# Altium project arca.PrjPCB
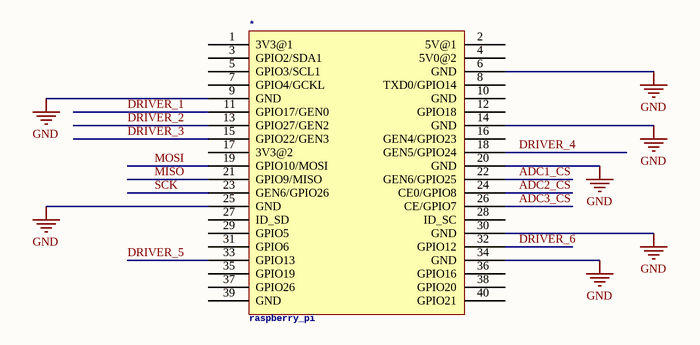
[diagram p0: PI_SCH.SchDoc]
9 sheets, 193 parts. Net scope: global (net labels, ports and power ports of the same name join across sheets).
Board file: arca.PcbDoc
Sheets:
  PI_SCH.SchDoc
  Power.SchDoc
  PT_to_ADCs.SchDoc
  LC_to_ADC.SchDoc
  ADC_SCH.SchDoc
  Load_Cells_SCH.SchDoc
  Pressure_Transducers_SCH.SchDoc
  Connectors.SchDoc
  drivers_SCH.SchDoc

## Sheet PI_SCH.SchDoc
size A

### Parts
*  raspberry_pi

### Nets
GND: *.6(GND) *.9(GND) *.14(GND) *.20(GND) *.25(GND) *.30(GND) *.34(GND)
ADC1_CS: *.22(GEN6/GPIO25)
ADC2_CS: *.24(CE0/GPIO8)
ADC3_CS: *.26(CE/GPIO7)
DRIVER_1: *.11(GPIO17/GEN0)
DRIVER_2: *.13(GPIO27/GEN2)
DRIVER_3: *.15(GPIO22/GEN3)
DRIVER_4: *.18(GEN5/GPIO24)
DRIVER_5: *.33(GPIO13)
DRIVER_6: *.32(GPIO12)
MISO: *.21(GPIO9/MISO)
MOSI: *.19(GPIO10/MOSI)
SCK: *.23(GEN6/GPIO26)

Not connected (* = marked no-connect by the designer): * 1(3V3@1) 2(5V@1) 3(GPIO2/SDA1) 4(5V0@2) 5(GPIO3/SCL1) 7(GPIO4/GCKL) 8(TXD0/GPIO14) 10(GND) 12(GPIO18) 16(GEN4/GPIO23) 17(3V3@2) 27(ID_SD) 28(ID_SC) 29(GPIO5) 31(GPIO6) 35(GPIO19) 36(GPIO16) 37(GPIO26) 38(GPIO20) 39(GND) 40(GPIO21)

## Sheet Power.SchDoc
size A
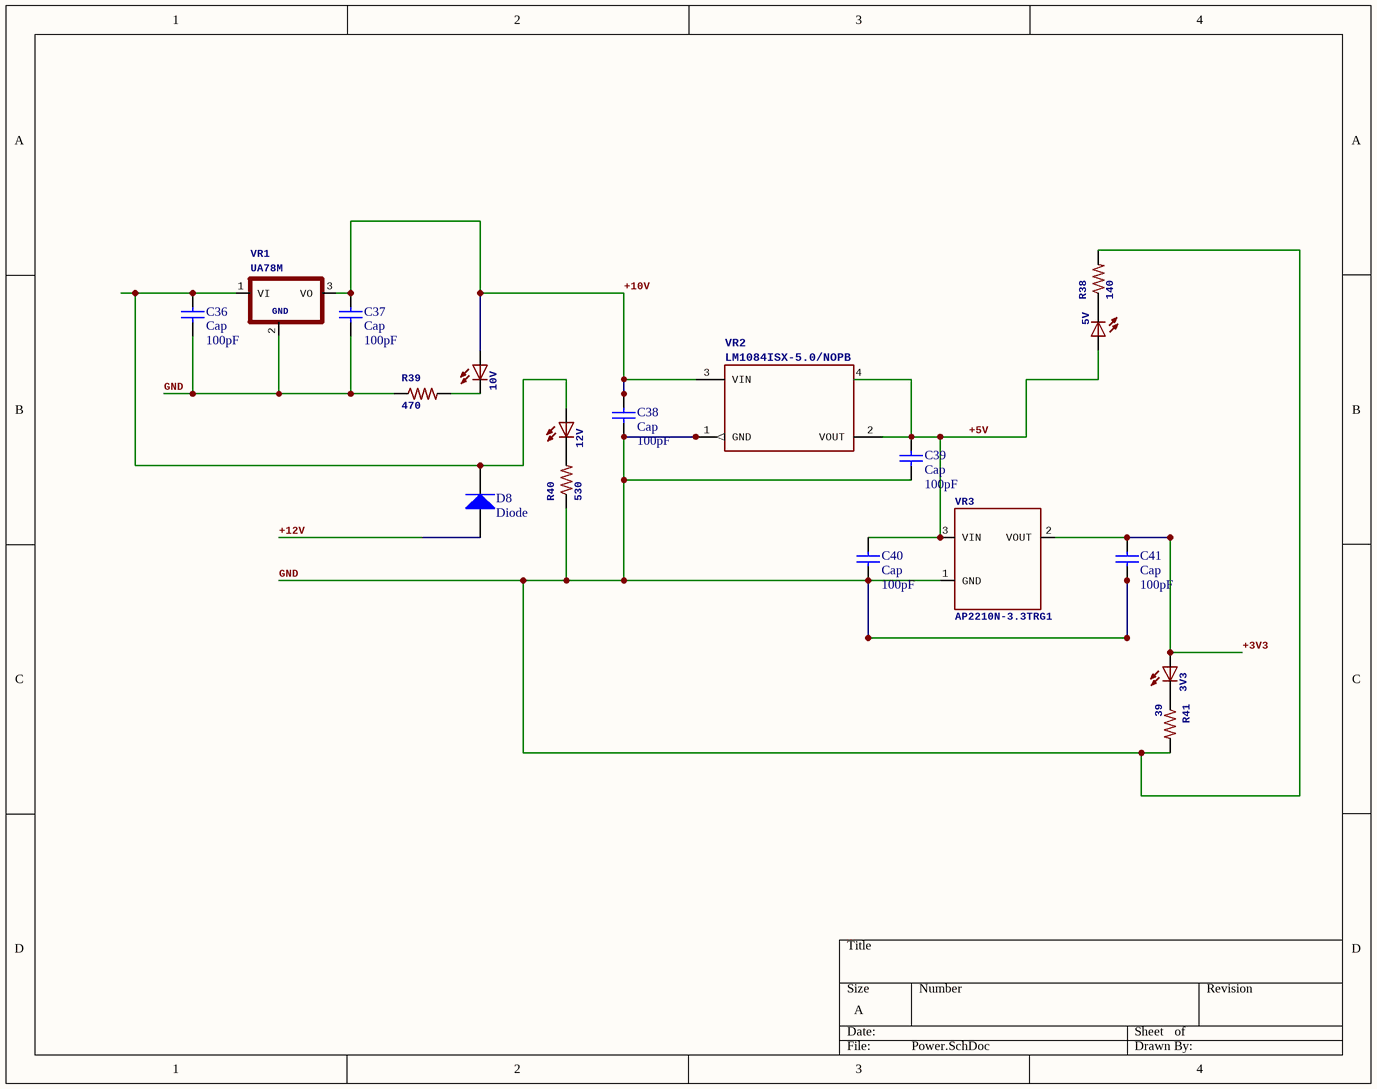
[diagram p1: Power.SchDoc]

### Parts
3V3  LED5MM  [LED5MM]  (value not drawn)
5V  LED5MM  [LED5MM]  (value not drawn)
10V  LED5MM  [LED5MM]  (value not drawn)
12V  LED5MM  [LED5MM]  (value not drawn)
C36  Cap  value 100pF  [CAPCP2012X06N]
C37  Cap  value 100pF  [CAPCP2012X06N]
C38  Cap  value 100pF  [CAPCP2012X06N]
C39  Cap  value 100pF  [CAPCP2012X06N]
C40  Cap  value 100pF  [CAPCP2012X06N]
C41  Cap  value 100pF  [CAPCP2012X06N]
D8  Diode  [DIODE-0.7]
R38  140  [RESC_0805_2012]
R39  470  [RESC_0805_2012]
R40  530  [RESC_0805_2012]
R41  39  [RESC_0805_2012]
VR1  UA78M  [UA78M]
VR2  LM1084ISX-5.0/NOPB  [LM1084ISX-5.0/NOPB]
VR3  AP2210N-3.3TRG1  [SOT95P245X110-3N]

### Nets
+3V3: 3V3.A C41.2 VR3.2(VOUT)
GND: C36.1 C37.1 C38.1 C39.1 C40.1 C41.1 R38.2 R39.1 R40.1 R41.2 VR1.2(GND) VR2.1(GND) VR3.1(GND)
+5V: 5V.A C39.2 C40.2 VR2.2(VOUT) VR2.4 VR3.3(VIN)
+10V: 10V.A C37.2 C38.2 VR1.3(VO) VR2.3(VIN)
+12V: D8.1(A)
Net3V3_K: 3V3.K(C) R41.1
Net5V_K: 5V.K(C) R38.1
Net10V_K: 10V.K(C) R39.2
Net12V_A: 12V.A C36.2 D8.2(K) VR1.1(VI)
Net12V_K: 12V.K(C) R40.2

### Library data of the parts
3V3 5V 10V 12V = LED5MM: LEDOSRAM:- CHIPLEDLG R971, LG N971, LY N971, LG Q971, LY Q971, LO R971, LY R971 LH N974, LH R974LS Q976, LO Q976, LY Q976LO Q996- Hyper CHIPLEDLW Q18SLB Q993, LB Q99A, LB R99A- SideLEDLS A670, LO A670, LY A670, LG A670, LP A670LB A673, LV A673, LT A673, LW A673LH A674LY A675LS A676, LA A676, LO A676, LY A676, LW A676LS A679, LY A679, LG A679-  Hyper Micro SIDELEDÂ®LS Y876, LA Y876, LO Y876, LY Y876LT Y87S- SmartLEDLW L88C, LW L88SLB L89C, LB L89S, LG L890LS L89K, LO L89K, LY L89KLS L896, LA L896, LO L896, LY L896- TOPLEDLS T670, LO T670, LY T670, LG T670, LP T670LSG T670, LSP T670, LSY T670, LOP T670, LYG T670LG T671, LOG T671, LSG T671LB T673, LV T673, LT T673, LW T673LH T674LS T676, LA T676, LO T676, LY T676, LB T676, LH T676, LSB T676, LW T676LB T67C, LV T67C, LT T67C, LS T67K, LO T67K, LY T67K, LW E67CLS E67B, LA E67B, LO E67B, LY E67B, LB E67C, LV E67C, LT E67CLW T67CLS T679, LY T679, LG T679LS T770, LO T770, LY T770, LG T770, LP T770LB T773, LV T773, LT T773, LW T773LH T774LS E675, LA E675, LY E675, LS T675LS T776, LA T776, LO T776, LY T776, LB T776LHGB T686LT T68C, LB T68C- Hyper Mini TOPLEDÂ®LB M676- Mini TOPLED SantanaÂ®LG M470LS M47K, LO M47K, LY M47K Source: http://www.osram.convergy.deLUXEON:- LUMILEDÂ®LXK2-PW12-R00, LXK2-PW12-S00, LXK2-PW14-U00, LXK2-PW14-V00LXK2-PM12-R00, LXK2-PM12-S00, LXK2-PM14-U00LXK2-PE12-Q00, LXK2-PE12-R00, LXK2-PE12-S00, LXK2-PE14-T00, LXK2-PE14-U00LXK2-PB12-K00, LXK2-PB12-L00, LXK2-PB12-M00, LXK2-PB14-N00, LXK2-PB14-P00, LXK2-PB14-Q00LXK2-PR12-L00, LXK2-PR12-M00, LXK2-PR14-Q00, LXK2-PR14-R00LXK2-PD12-Q00, LXK2-PD12-R00, LXK2-PD12-S00LXK2-PH12-R00, LXK2-PH12-S00LXK2-PL12-P00, LXK2-PL12-Q00, LXK2-PL12-R00 Source: www.luxeon.comKINGBRIGHT:KA-3528ASYCSource: www.kingbright.com; GateName_1: G$1; SymbolName_1: LED; DeviceName: 5MM; LibraryName: led; DeviceSetName: LED
C36-C41 = Cap: Capacitor; Published: 8-Jun-2000; LatestRevisionDate: 17-Jul-2002; LatestRevisionNote: Re-released for DXP Platform.; PackageReference: RAD-0.3; Publisher: Altium Limited; PackageDescription: Radial Cap, Thru-Hole; 2 Leads; 0.3 in Pin Spacing
D8 = Diode: Default Diode; Published: 8-Jun-2000; LatestRevisionDate: 17-Jul-2002; LatestRevisionNote: Re-released for DXP Platform.; PackageVersion: Sep-1996; PackageReference: SMC; Publisher: Altium Limited; PackageDescription: DO-214-AB/SMC; 2 C-Bend Leads; Body 7.9 x 5.9 mm, inc. leads (LxW); Code_JEDEC: DO-214-AB
R38-R41 = R-US_R0805: RESISTOR, American symbol; GateName_1: G$1; SymbolName_1: R-US; DeviceName: R0805; DeviceSetName: R-US_; LibraryName: resistor
VR1 = UA78M*: POSITIVE-VOLTAGE REGULATORS Source: http://focus.ti.com/lit/ds/symlink/ua78m33.pdf; GateName_1: G$1; SymbolName_1: 78XX2GND; LibraryName: texas-extra; DeviceSetName: UA78M*; GND: GND
VR2 = LM1084ISX-5.0/NOPB: MANUFACTURER_PART_NUMBER: LM1084ISX5.0NOPB; GateName_1: A; SymbolName_1: LM1084IS-5.0; VENDOR: Texas Instruments; LibraryName: texas-extra; DeviceSetName: LM1084ISX-5.0/NOPB
VR3 = AP2210N-3.3TRG1: 3.3V regulator300mA rating.; GateName_1: G$1; SymbolName_1: AP2210N-3.3TRG1; LibraryName: diodes-extra; DeviceSetName: AP2210N-3.3TRG1

## Sheet PT_to_ADCs.SchDoc
size A
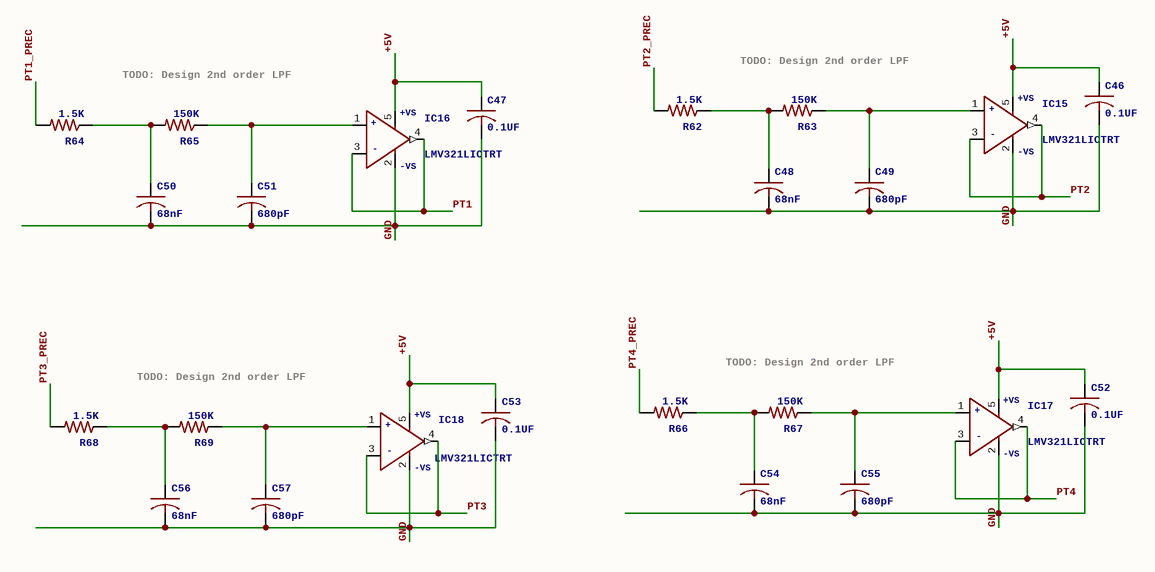
[diagram p2: PT_to_ADCs.SchDoc]

### Parts
C46  0.1UF  [CAPCP2012X06N]
C47  0.1UF  [CAPCP2012X06N]
C48  68nF  [CAPCP2012X06N]
C49  680pF  [CAPCP2012X06N]
C50  68nF  [CAPCP2012X06N]
C51  680pF  [CAPCP2012X06N]
C52  0.1UF  [CAPCP2012X06N]
C53  0.1UF  [CAPCP2012X06N]
C54  68nF  [CAPCP2012X06N]
C55  680pF  [CAPCP2012X06N]
C56  68nF  [CAPCP2012X06N]
C57  680pF  [CAPCP2012X06N]
IC15  LMV321LICTRT  [SOT95P245X110-5N]
IC16  LMV321LICTRT  [SOT95P245X110-5N]
IC17  LMV321LICTRT  [SOT95P245X110-5N]
IC18  LMV321LICTRT  [SOT95P245X110-5N]
R62  1.5K  [RESC_0805_2012]
R63  150K  [RESC_0805_2012]
R64  1.5K  [RESC_0805_2012]
R65  150K  [RESC_0805_2012]
R66  1.5K  [RESC_0805_2012]
R67  150K  [RESC_0805_2012]
R68  1.5K  [RESC_0805_2012]
R69  150K  [RESC_0805_2012]

### Nets
GND: C46.2 C47.2 C48.2 C49.2 C50.2 C51.2 C52.2 C53.2 C54.2 C55.2 C56.2 C57.2 IC15.2(-VS) IC16.2(-VS) IC17.2(-VS) IC18.2(-VS)
+5V: C46.1 C47.1 C52.1 C53.1 IC15.5(+VS) IC16.5(+VS) IC17.5(+VS) IC18.5(+VS)
PT1: IC16.3(IN-) IC16.4(OUT)
PT1_PREC: R64.2
PT2: IC15.3(IN-) IC15.4(OUT)
PT2_PREC: R62.2
PT3: IC18.3(IN-) IC18.4(OUT)
PT3_PREC: R68.2
PT4: IC17.3(IN-) IC17.4(OUT)
PT4_PREC: R66.2
NetC48_1: C48.1 R62.1 R63.2
NetC49_1: C49.1 IC15.1(IN+) R63.1
NetC50_1: C50.1 R64.1 R65.2
NetC51_1: C51.1 IC16.1(IN+) R65.1
NetC54_1: C54.1 R66.1 R67.2
NetC55_1: C55.1 IC17.1(IN+) R67.1
NetC56_1: C56.1 R68.1 R69.2
NetC57_1: C57.1 IC18.1(IN+) R69.1

### Notes on the sheet
- TODO: Design 2nd order LPF

### Library data of the parts
C46-C57 = C-USC0805: CAPACITOR, American symbol; GateName_1: G$1; SymbolName_1: C-US; DeviceName: C0805; LibraryName: rcl; DeviceSetName: C-US; SPICEPREFIX: C
IC15-IC18 = LMV321LICTRT: High Performance, 145 MHz FastFET Op AmpsSource: http://www.analog.com/static/imported-files/data_sheets/AD8065_8066.pdf; MPN: AD8065ARTZ-REEL7; GateName_1: G$; SymbolName_1: OP+-VS; DeviceName: RT; MF: ALTERA CORPORATION; LibraryName: st-microelectronics-extra; DeviceSetName: LMV321LICT; OC_FARNELL: 1464845; OC_NEWARK: 59K6316; +: +; -: -; +VS: +VS; -VS: -VS
R62-R69 = R-US_R0805: as R38 on sheet Power; LibraryName: rcl

## Sheet LC_to_ADC.SchDoc
size A
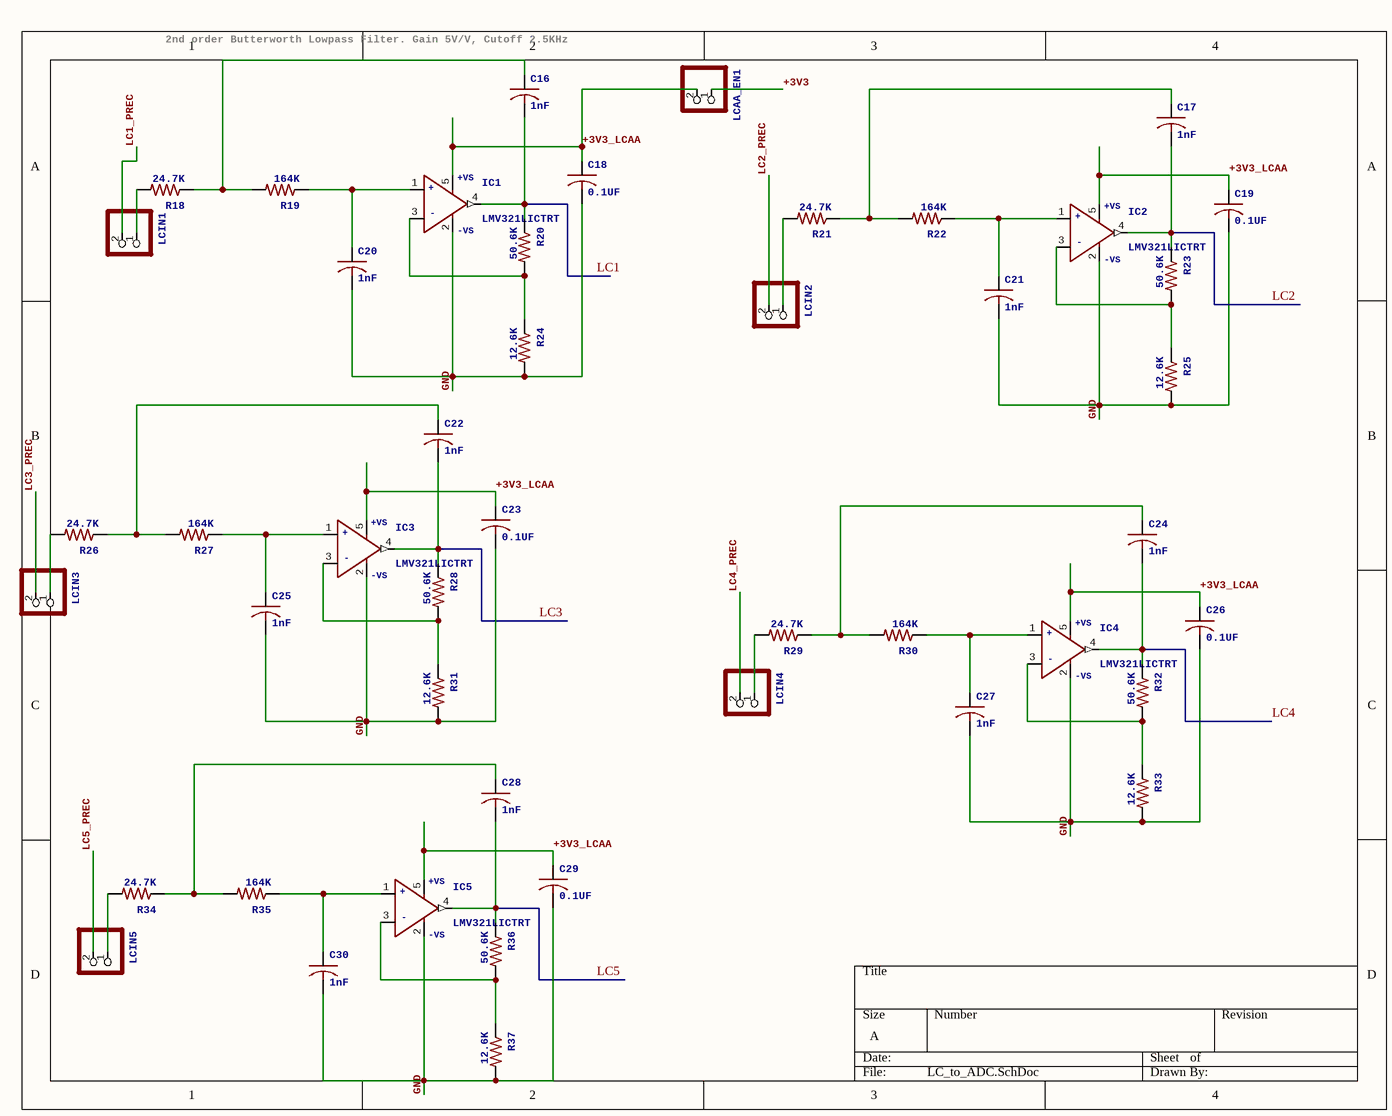
[diagram p3: LC_to_ADC.SchDoc]

### Parts
C16  1nF  [CAPCP2012X06N]
C17  1nF  [CAPCP2012X06N]
C18  0.1UF  [CAPCP2012X06N]
C19  0.1UF  [CAPCP2012X06N]
C20  1nF  [CAPCP2012X06N]
C21  1nF  [CAPCP2012X06N]
C22  1nF  [CAPCP2012X06N]
C23  0.1UF  [CAPCP2012X06N]
C24  1nF  [CAPCP2012X06N]
C25  1nF  [CAPCP2012X06N]
C26  0.1UF  [CAPCP2012X06N]
C27  1nF  [CAPCP2012X06N]
C28  1nF  [CAPCP2012X06N]
C29  0.1UF  [CAPCP2012X06N]
C30  1nF  [CAPCP2012X06N]
IC1  LMV321LICTRT  [SOT95P245X110-5N]
IC2  LMV321LICTRT  [SOT95P245X110-5N]
IC3  LMV321LICTRT  [SOT95P245X110-5N]
IC4  LMV321LICTRT  [SOT95P245X110-5N]
IC5  LMV321LICTRT  [SOT95P245X110-5N]
LCAA_EN1  PINHD-1X2  [MHDR1X2]  (value not drawn)
LCIN1  PINHD-1X2  [MHDR1X2]  (value not drawn)
LCIN2  PINHD-1X2  [MHDR1X2]  (value not drawn)
LCIN3  PINHD-1X2  [MHDR1X2]  (value not drawn)
LCIN4  PINHD-1X2  [MHDR1X2]  (value not drawn)
LCIN5  PINHD-1X2  [MHDR1X2]  (value not drawn)
R18  24.7K  [RESC_0805_2012]
R19  164K  [RESC_0805_2012]
R20  50.6K  [RESC_0805_2012]
R21  24.7K  [RESC_0805_2012]
R22  164K  [RESC_0805_2012]
R23  50.6K  [RESC_0805_2012]
R24  12.6K  [RESC_0805_2012]
R25  12.6K  [RESC_0805_2012]
R26  24.7K  [RESC_0805_2012]
R27  164K  [RESC_0805_2012]
R28  50.6K  [RESC_0805_2012]
R29  24.7K  [RESC_0805_2012]
R30  164K  [RESC_0805_2012]
R31  12.6K  [RESC_0805_2012]
R32  50.6K  [RESC_0805_2012]
R33  12.6K  [RESC_0805_2012]
R34  24.7K  [RESC_0805_2012]
R35  164K  [RESC_0805_2012]
R36  50.6K  [RESC_0805_2012]
R37  12.6K  [RESC_0805_2012]

### Nets
+3V3: LCAA_EN1.1
GND: C18.2 C19.2 C20.2 C21.2 C23.2 C25.2 C26.2 C27.2 C29.2 C30.2 IC1.2(-VS) IC2.2(-VS) IC3.2(-VS) IC4.2(-VS) IC5.2(-VS) R24.2 R25.2 R31.2 R33.2 R37.2
+3V3_LCAA: C18.1 C19.1 C23.1 C26.1 C29.1 IC1.5(+VS) IC2.5(+VS) IC3.5(+VS) IC4.5(+VS) IC5.5(+VS) LCAA_EN1.2
LC1: C16.2 IC1.4(OUT) R20.1
LC1_PREC: LCIN1.2
LC2: C17.2 IC2.4(OUT) R23.1
LC2_PREC: LCIN2.2
LC3: C22.2 IC3.4(OUT) R28.1
LC3_PREC: LCIN3.2
LC4: C24.2 IC4.4(OUT) R32.1
LC4_PREC: LCIN4.2
LC5: C28.2 IC5.4(OUT) R36.1
LC5_PREC: LCIN5.2
NetC16_1: C16.1 R18.1 R19.2
NetC17_1: C17.1 R21.1 R22.2
NetC20_1: C20.1 IC1.1(IN+) R19.1
NetC21_1: C21.1 IC2.1(IN+) R22.1
NetC22_1: C22.1 R26.1 R27.2
NetC24_1: C24.1 R29.1 R30.2
NetC25_1: C25.1 IC3.1(IN+) R27.1
NetC27_1: C27.1 IC4.1(IN+) R30.1
NetC28_1: C28.1 R34.1 R35.2
NetC30_1: C30.1 IC5.1(IN+) R35.1
NetIC1_3: IC1.3(IN-) R20.2 R24.1
NetIC2_3: IC2.3(IN-) R23.2 R25.1
NetIC3_3: IC3.3(IN-) R28.2 R31.1
NetIC4_3: IC4.3(IN-) R32.2 R33.1
NetIC5_3: IC5.3(IN-) R36.2 R37.1
NetLCIN1_1: LCIN1.1 R18.2
NetLCIN2_1: LCIN2.1 R21.2
NetLCIN3_1: LCIN3.1 R26.2
NetLCIN4_1: LCIN4.1 R29.2
NetLCIN5_1: LCIN5.1 R34.2

### Notes on the sheet
- 2nd order Butterworth Lowpass Filter. Gain 5V/V, Cutoff 2.5KHz

### Library data of the parts
C16-C30 = C-USC0805: as C46 on sheet PT_to_ADCs; LibraryName: rcl; DeviceSetName: C-US; SPICEPREFIX: C
IC1-IC5 = LMV321LICTRT: as IC15 on sheet PT_to_ADCs; LibraryName: st-microelectronics-extra; DeviceSetName: LMV321LICT; OC_FARNELL: 1464845; OC_NEWARK: 59K6316; +: +; -: -; +VS: +VS; -VS: -VS
LCAA_EN1 LCIN1-LCIN5 = PINHD-1X2: PIN HEADER; GateName_1: G$1; SymbolName_1: PINHD2; LibraryName: pinhead; DeviceSetName: PINHD-1X2
R18-R37 = R-US_R0805: as R38 on sheet Power; LibraryName: rcl

## Sheet ADC_SCH.SchDoc
size A
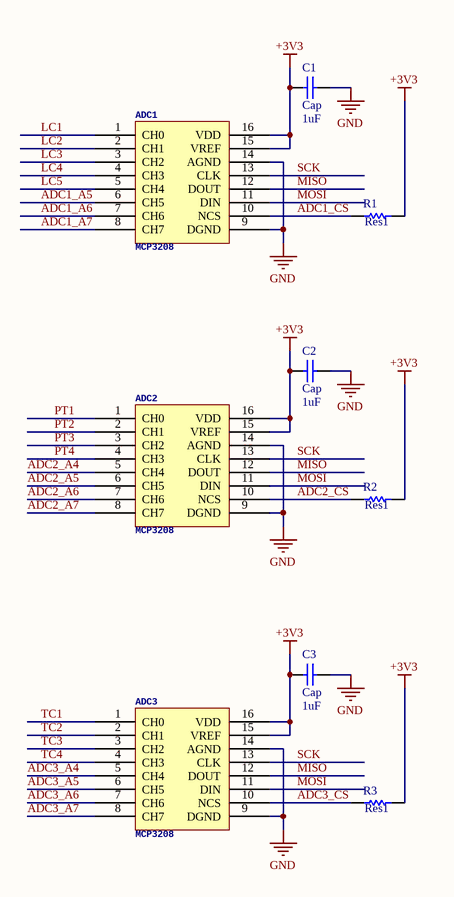
[diagram p4: ADC_SCH.SchDoc]

### Parts
ADC1  MCP3208
ADC2  MCP3208
ADC3  MCP3208
C1  Cap  value 1uF  [CAPCP2012X06N]
C2  Cap  value 1uF  [CAPCP2012X06N]
C3  Cap  value 1uF  [CAPCP2012X06N]
R1  Res1  [RESC_0805_2012]
R2  Res1  [RESC_0805_2012]
R3  Res1  [RESC_0805_2012]

### Nets
+3V3: ADC1.15(VREF) ADC1.16(VDD) ADC2.15(VREF) ADC2.16(VDD) ADC3.15(VREF) ADC3.16(VDD) C1.1 C2.1 C3.1 R1.2 R2.2 R3.2
GND: ADC1.9(DGND) ADC1.14(AGND) ADC2.9(DGND) ADC2.14(AGND) ADC3.9(DGND) ADC3.14(AGND) C1.2 C2.2 C3.2
ADC1_A5: ADC1.6(CH5)
ADC1_A6: ADC1.7(CH6)
ADC1_A7: ADC1.8(CH7)
ADC1_CS: ADC1.10(NCS) R1.1
ADC2_A4: ADC2.5(CH4)
ADC2_A5: ADC2.6(CH5)
ADC2_A6: ADC2.7(CH6)
ADC2_A7: ADC2.8(CH7)
ADC2_CS: ADC2.10(NCS) R2.1
ADC3_A4: ADC3.5(CH4)
ADC3_A5: ADC3.6(CH5)
ADC3_A6: ADC3.7(CH6)
ADC3_A7: ADC3.8(CH7)
ADC3_CS: ADC3.10(NCS) R3.1
LC1: ADC1.1(CH0)
LC2: ADC1.2(CH1)
LC3: ADC1.3(CH2)
LC4: ADC1.4(CH3)
LC5: ADC1.5(CH4)
MISO: ADC1.12(DOUT) ADC2.12(DOUT) ADC3.12(DOUT)
MOSI: ADC1.11(DIN) ADC2.11(DIN) ADC3.11(DIN)
PT1: ADC2.1(CH0)
PT2: ADC2.2(CH1)
PT3: ADC2.3(CH2)
PT4: ADC2.4(CH3)
SCK: ADC1.13(CLK) ADC2.13(CLK) ADC3.13(CLK)
TC1: ADC3.1(CH0)
TC2: ADC3.2(CH1)
TC3: ADC3.3(CH2)
TC4: ADC3.4(CH3)

### Library data of the parts
C1-C3 = Cap: Capacitor; Published: 8-Jun-2000; LatestRevisionDate: 17-Jul-2002; LatestRevisionNote: Re-released for DXP Platform.; PackageReference: RAD-0.3; Publisher: Altium Limited; PackageDescription: Radial Cap, Thru-Hole; 2 Leads; 0.3 in Pin Spacing
R1-R3 = Res1: Resistor; Published: 8-Jun-2000; LatestRevisionDate: 17-Jul-2002; LatestRevisionNote: Re-released for DXP Platform.; PackageReference: AXIAL-0.3; Publisher: Altium Limited; PackageDescription: Axial Device, Thru-Hole; 2 Leads; 0.3 in Pin Spacing

## Sheet Load_Cells_SCH.SchDoc
size A
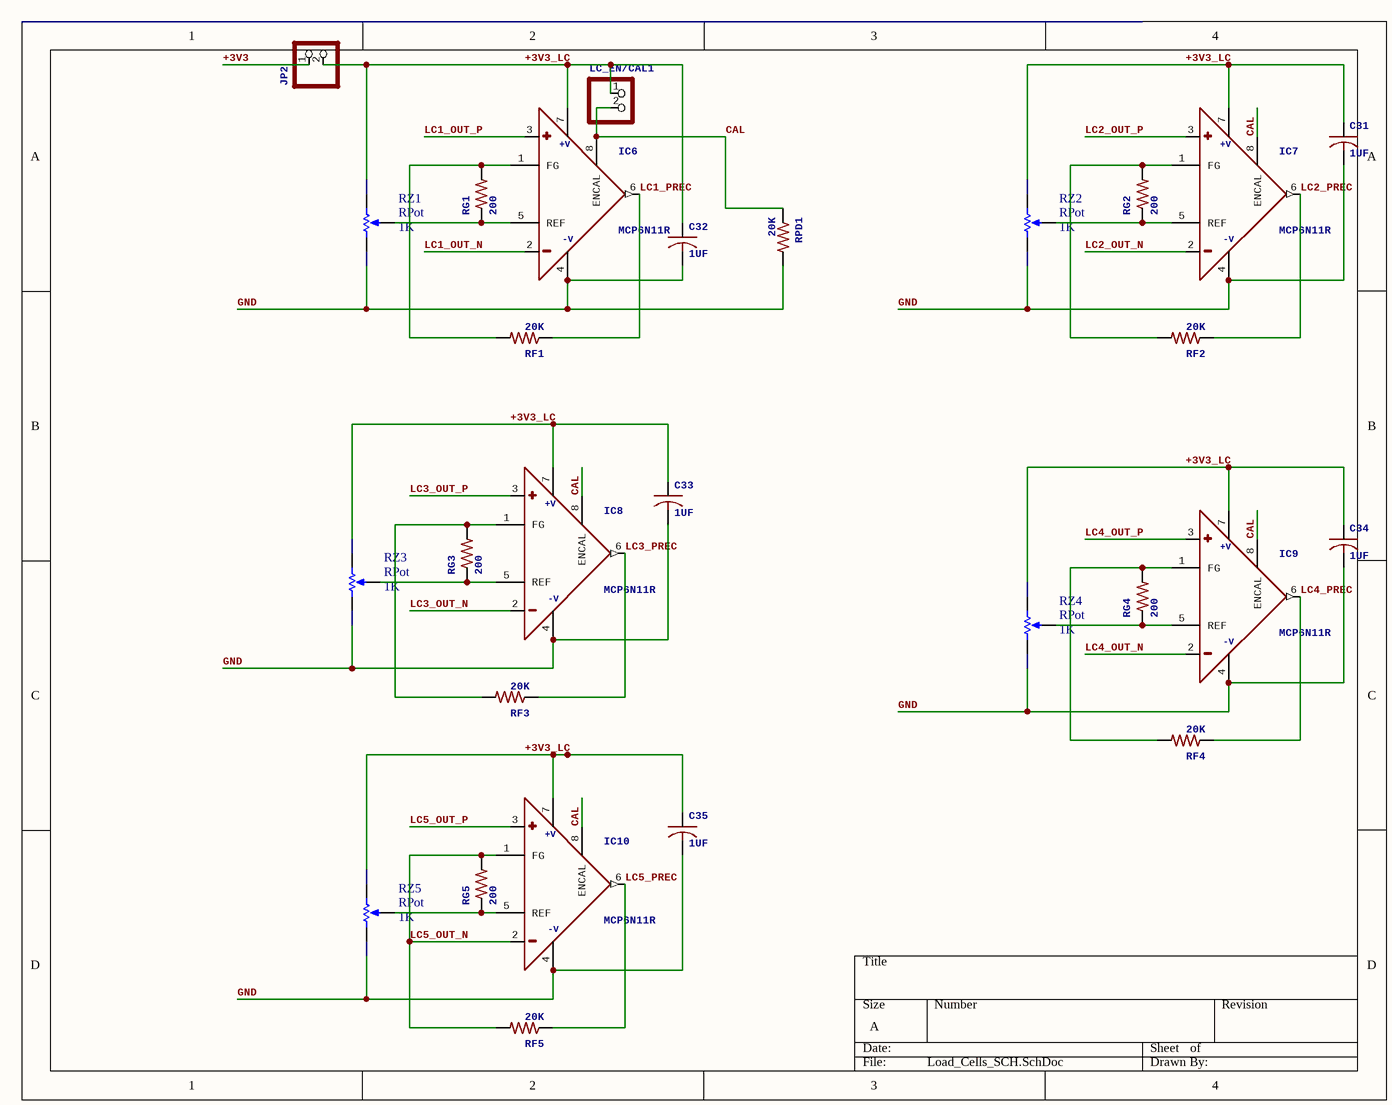
[diagram p5: Load_Cells_SCH.SchDoc]

### Parts
C31  1UF  [CAPCP2012X06N]
C32  1UF  [CAPCP2012X06N]
C33  1UF  [CAPCP2012X06N]
C34  1UF  [CAPCP2012X06N]
C35  1UF  [CAPCP2012X06N]
IC6  MCP6N11R  [SOIC127P1030X265-8N]
IC7  MCP6N11R  [SOIC127P1030X265-8N]
IC8  MCP6N11R  [SOIC127P1030X265-8N]
IC9  MCP6N11R  [SOIC127P1030X265-8N]
IC10  MCP6N11R  [SOIC127P1030X265-8N]
JP2  PINHD-1X2  [MHDR1X2]  (value not drawn)
LC_EN/CAL1  PINHD-1X2  [MHDR1X2]  (value not drawn)
RF1  20K  [RESC_0805_2012]
RF2  20K  [RESC_0805_2012]
RF3  20K  [RESC_0805_2012]
RF4  20K  [RESC_0805_2012]
RF5  20K  [RESC_0805_2012]
RG1  200  [RESC_0805_2012]
RG2  200  [RESC_0805_2012]
RG3  200  [RESC_0805_2012]
RG4  200  [RESC_0805_2012]
RG5  200  [RESC_0805_2012]
RPD1  20K  [RESC_0805_2012]
RZ1  RPot  value 1K  [VR5]
RZ2  RPot  value 1K  [VR5]
RZ3  RPot  value 1K  [VR5]
RZ4  RPot  value 1K  [VR5]
RZ5  RPot  value 1K  [VR5]

### Nets
+3V3: JP2.1
GND: C31.2 C32.2 C33.2 C34.2 C35.2 IC6.4(-V) IC7.4(-V) IC8.4(-V) IC9.4(-V) IC10.4(-V) RPD1.2 RZ1.1(TOP) RZ2.1(TOP) RZ3.1(TOP) RZ4.1(TOP) RZ5.1(TOP)
+3V3_LC: C31.1 C32.1 C33.1 C34.1 C35.1 IC6.7(+V) IC7.7(+V) IC8.7(+V) IC9.7(+V) IC10.7(+V) JP2.2 LC_EN/CAL1.1 RZ1.2(BOT) RZ2.2(BOT) RZ3.2(BOT) RZ4.2(BOT) RZ5.2(BOT)
CAL: IC6.8(ENCAL) IC7.8(ENCAL) IC8.8(ENCAL) IC9.8(ENCAL) IC10.8(ENCAL) LC_EN/CAL1.2 RPD1.1
LC1_OUT_N: IC6.2(-)
LC1_OUT_P: IC6.3(+)
LC1_PREC: IC6.6(OUT) RF1.1
LC2_OUT_N: IC7.2(-)
LC2_OUT_P: IC7.3(+)
LC2_PREC: IC7.6(OUT) RF2.1
LC3_OUT_N: IC8.2(-)
LC3_OUT_P: IC8.3(+)
LC3_PREC: IC8.6(OUT) RF3.1
LC4_OUT_N: IC9.2(-)
LC4_OUT_P: IC9.3(+)
LC4_PREC: IC9.6(OUT) RF4.1
LC5_OUT_N: IC10.1(FG) IC10.2(-) RF5.2 RG5.2
LC5_OUT_P: IC10.3(+)
LC5_PREC: IC10.6(OUT) RF5.1
NetIC6_1: IC6.1(FG) RF1.2 RG1.2
NetIC6_5: IC6.5(REF) RG1.1 RZ1.3(TAP)
NetIC7_1: IC7.1(FG) RF2.2 RG2.2
NetIC7_5: IC7.5(REF) RG2.1 RZ2.3(TAP)
NetIC8_1: IC8.1(FG) RF3.2 RG3.2
NetIC8_5: IC8.5(REF) RG3.1 RZ3.3(TAP)
NetIC9_1: IC9.1(FG) RF4.2 RG4.2
NetIC9_5: IC9.5(REF) RG4.1 RZ4.3(TAP)
NetIC10_5: IC10.5(REF) RG5.1 RZ5.3(TAP)

### Library data of the parts
C31-C35 = C-USC0805: as C46 on sheet PT_to_ADCs; LibraryName: rcl; DeviceSetName: C-US; SPICEPREFIX: C
IC6-IC10 = MCP6N11R: Low Cost, Low Power, Instrumentation AmplifierSource: http://www.analog.com/UploadedFiles/Data_Sheets/37793330023930AD620_e.pdf; MPN: AD620AR; GateName_1: G$1; DeviceName: R; SymbolName_1: MCP6N11; LibraryName: microchip-extra; DeviceSetName: MCP6N11; MF: *; OC_FARNELL: 1464424; OC_NEWARK: 05F7109; +V: +V; -V: -V
JP2 LC_EN/CAL1 = PINHD-1X2: as LCAA_EN1 on sheet LC_to_ADC; LibraryName: pinhead; DeviceSetName: PINHD-1X2
RF1-RF5 RG1-RG5 RPD1 = R-US_R0805: as R38 on sheet Power; LibraryName: rcl
RZ1-RZ5 = RPot: Potentiometer; Sim Note: Enter the Resistance value and the set point into parameter fields.; Set Position: 0.5; Published: 8-Jun-2000; LatestRevisionDate: 17-Jul-2002; LatestRevisionNote: Re-released for DXP Platform.; PackageReference: VR5; Publisher: Altium Limited; PackageDescription: Variable Resistor, Thru-Hole; 3 Leads

## Sheet Pressure_Transducers_SCH.SchDoc
size B
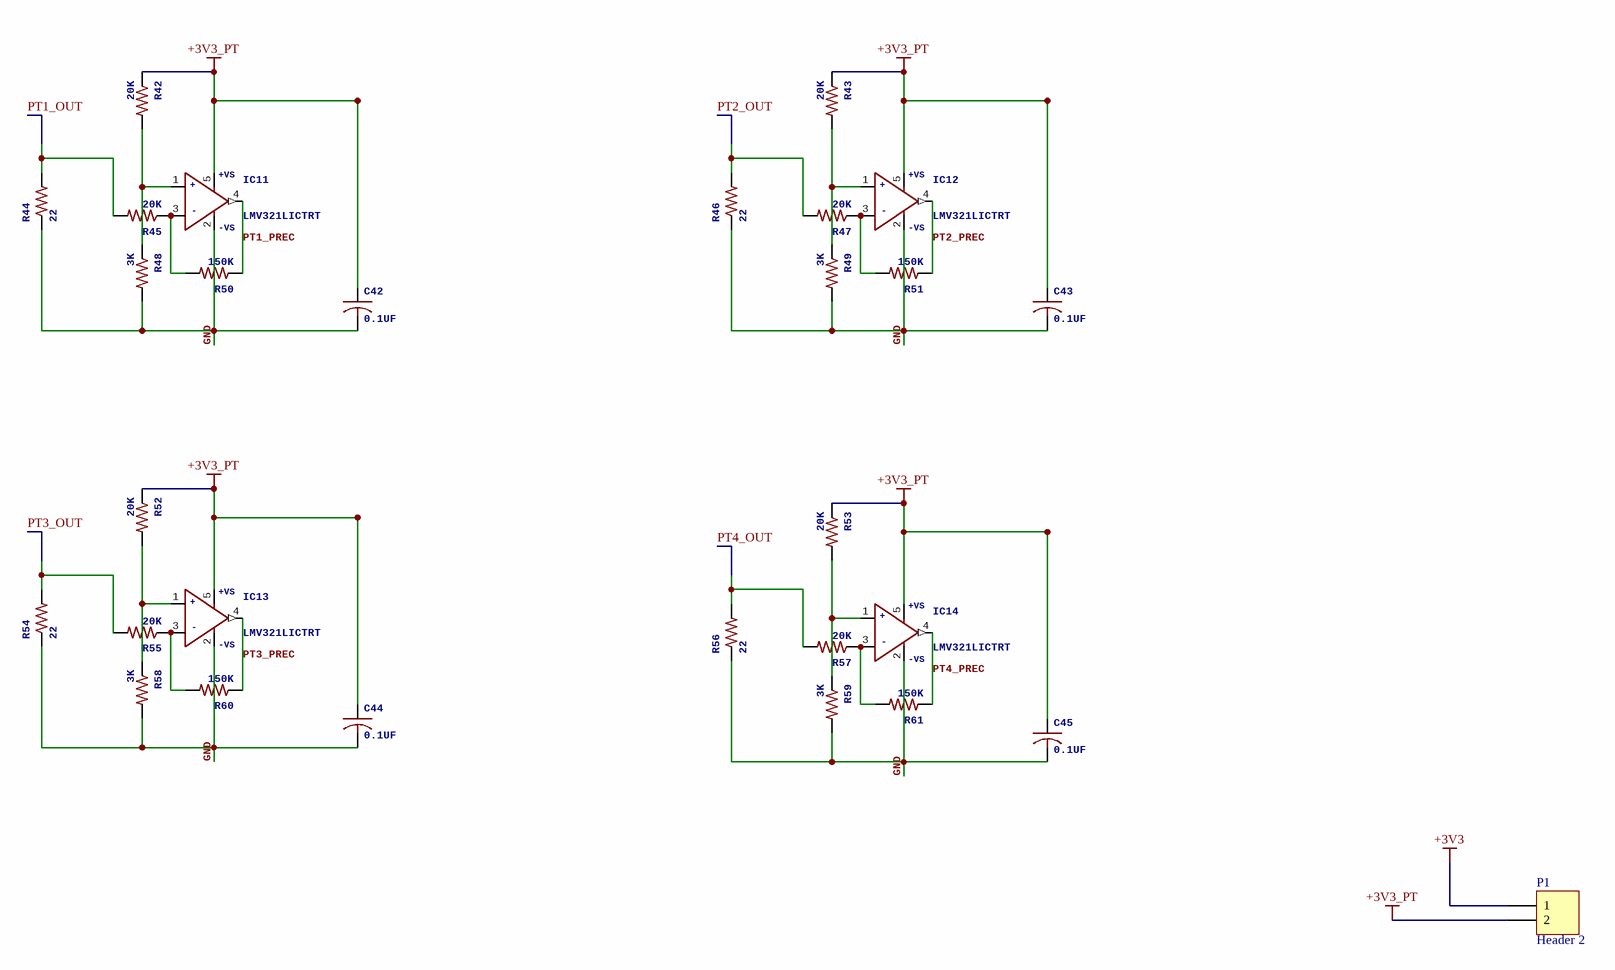
[diagram p6: Pressure_Transducers_SCH.SchDoc]

### Parts
C42  0.1UF  [CAPCP2012X06N]
C43  0.1UF  [CAPCP2012X06N]
C44  0.1UF  [CAPCP2012X06N]
C45  0.1UF  [CAPCP2012X06N]
IC11  LMV321LICTRT  [SOT95P245X110-5N]
IC12  LMV321LICTRT  [SOT95P245X110-5N]
IC13  LMV321LICTRT  [SOT95P245X110-5N]
IC14  LMV321LICTRT  [SOT95P245X110-5N]
P1  Header 2  [HDR1X2]
R42  20K  [RESC_0805_2012]
R43  20K  [RESC_0805_2012]
R44  22  [RESC_0805_2012]
R45  20K  [RESC_0805_2012]
R46  22  [RESC_0805_2012]
R47  20K  [RESC_0805_2012]
R48  3K  [RESC_0805_2012]
R49  3K  [RESC_0805_2012]
R50  150K  [RESC_0805_2012]
R51  150K  [RESC_0805_2012]
R52  20K  [RESC_0805_2012]
R53  20K  [RESC_0805_2012]
R54  22  [RESC_0805_2012]
R55  20K  [RESC_0805_2012]
R56  22  [RESC_0805_2012]
R57  20K  [RESC_0805_2012]
R58  3K  [RESC_0805_2012]
R59  3K  [RESC_0805_2012]
R60  150K  [RESC_0805_2012]
R61  150K  [RESC_0805_2012]

### Nets
+3V3: P1.1
+3V3_PT: C42.1 C43.1 C44.1 C45.1 IC11.5(+VS) IC12.5(+VS) IC13.5(+VS) IC14.5(+VS) P1.2 R42.1 R43.1 R52.1 R53.1
GND: C42.2 C43.2 C44.2 C45.2 IC11.2(-VS) IC12.2(-VS) IC13.2(-VS) IC14.2(-VS) R44.1 R46.1 R48.2 R49.2 R54.1 R56.1 R58.2 R59.2
PT1_OUT: R44.2 R45.2
PT1_PREC: IC11.4(OUT) R50.1
PT2_OUT: R46.2 R47.2
PT2_PREC: IC12.4(OUT) R51.1
PT3_OUT: R54.2 R55.2
PT3_PREC: IC13.4(OUT) R60.1
PT4_OUT: R56.2 R57.2
PT4_PREC: IC14.4(OUT) R61.1
NetIC11_1: IC11.1(IN+) R42.2 R48.1
NetIC11_3: IC11.3(IN-) R45.1 R50.2
NetIC12_1: IC12.1(IN+) R43.2 R49.1
NetIC12_3: IC12.3(IN-) R47.1 R51.2
NetIC13_1: IC13.1(IN+) R52.2 R58.1
NetIC13_3: IC13.3(IN-) R55.1 R60.2
NetIC14_1: IC14.1(IN+) R53.2 R59.1
NetIC14_3: IC14.3(IN-) R57.1 R61.2

### Library data of the parts
C42-C45 = C-USC0805: as C46 on sheet PT_to_ADCs; LibraryName: rcl; DeviceSetName: C-US; SPICEPREFIX: C
IC11-IC14 = LMV321LICTRT: as IC15 on sheet PT_to_ADCs; LibraryName: st-microelectronics-extra; DeviceSetName: LMV321LICT; OC_FARNELL: 1464845; OC_NEWARK: 59K6316; +: +; -: -; +VS: +VS; -VS: -VS
P1 = Header 2: Header, 2-Pin; LatestRevisionDate: 17-Jul-2002; LatestRevisionNote: Re-released for DXP Platform.; Publisher: Altium Limited
R42-R61 = R-US_R0805: as R38 on sheet Power; LibraryName: rcl

## Sheet Connectors.SchDoc
size A
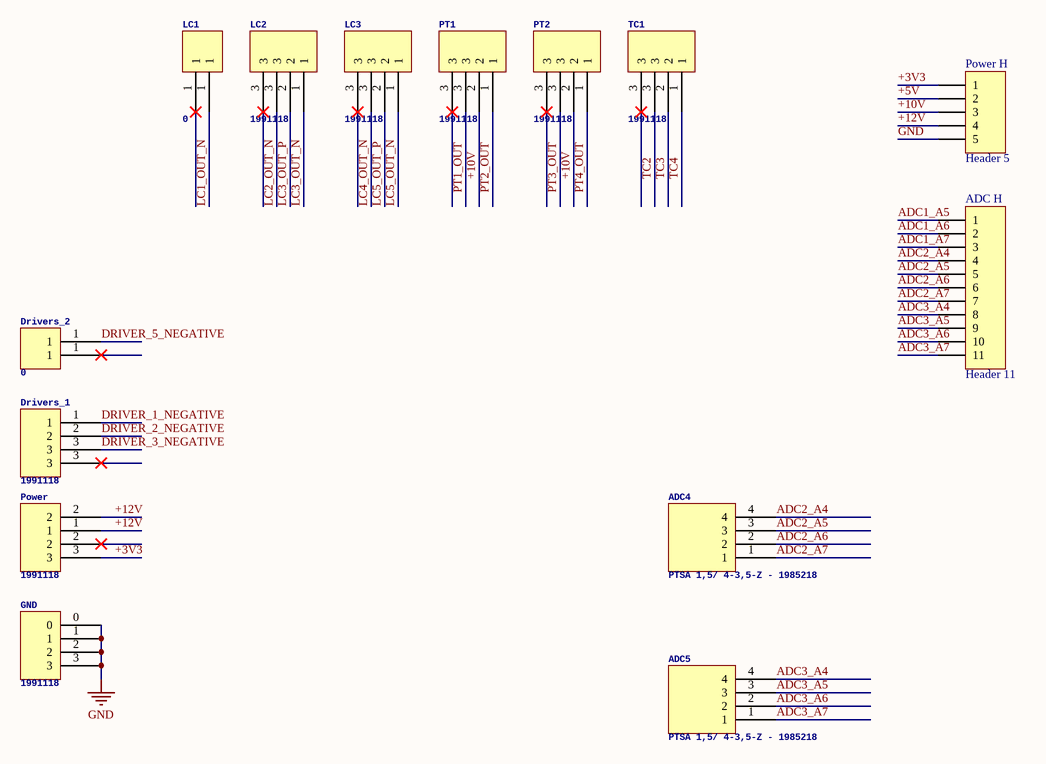
[diagram p7: Connectors.SchDoc]

### Parts
ADC4  PTSA 1,5/ 4-3,5-Z - 1985218
ADC5  PTSA 1,5/ 4-3,5-Z - 1985218
ADC_H  Header 11  [HDR1X11]
Drivers_1  1991118
Drivers_2  0
GND  1991118
LC1  0
LC2  1991118
LC3  1991118
Power  1991118
Power_H  Header 5  [HDR1X5]
PT1  1991118
PT2  1991118
TC1  1991118

### Nets
+3V3: Power.3 Power_H.1
GND: GND.0 GND.1 GND.2 GND.3 Power_H.5
+5V: Power_H.2
+10V: Power_H.3 PT1.2 PT2.2
+12V: Power.1 Power.2 Power_H.4
ADC1_A5: ADC_H.1
ADC1_A6: ADC_H.2
ADC1_A7: ADC_H.3
ADC2_A4: ADC4.4 ADC_H.4
ADC2_A5: ADC4.3 ADC_H.5
ADC2_A6: ADC4.2 ADC_H.6
ADC2_A7: ADC4.1 ADC_H.7
ADC3_A4: ADC5.4 ADC_H.8
ADC3_A5: ADC5.3 ADC_H.9
ADC3_A6: ADC5.2 ADC_H.10
ADC3_A7: ADC5.1 ADC_H.11
DRIVER_1_NEGATIVE: Drivers_1.1
DRIVER_2_NEGATIVE: Drivers_1.2
DRIVER_3_NEGATIVE: Drivers_1.3
DRIVER_5_NEGATIVE: Drivers_2.1
LC1_OUT_N: LC1.1
LC2_OUT_N: LC2.3
LC3_OUT_N: LC2.1
LC3_OUT_P: LC2.2
LC4_OUT_N: LC3.3
LC5_OUT_N: LC3.1
LC5_OUT_P: LC3.2
PT1_OUT: PT1.3
PT2_OUT: PT1.1
PT3_OUT: PT2.3
PT4_OUT: PT2.1
TC2: TC1.3
TC3: TC1.2
TC4: TC1.1

### Library data of the parts
ADC4 ADC5 = PTSA 1,5/ 4-3,5-Z - 1985218: Phoenix Contact PCB Terminal Spring Cage Clamp + Button 4 pos
ADC_H = Header 11: Header, 11-Pin; LatestRevisionDate: 17-Jul-2002; LatestRevisionNote: Re-released for DXP Platform.; Publisher: Altium Limited
Drivers_2 LC1 = 1991095: Phoenix Contact Connector PCB Terminal 2 port
Power_H = Header 5: Header, 5-Pin; LatestRevisionDate: 17-Jul-2002; LatestRevisionNote: Re-released for DXP Platform.; Publisher: Altium Limited

## Sheet drivers_SCH.SchDoc
size A
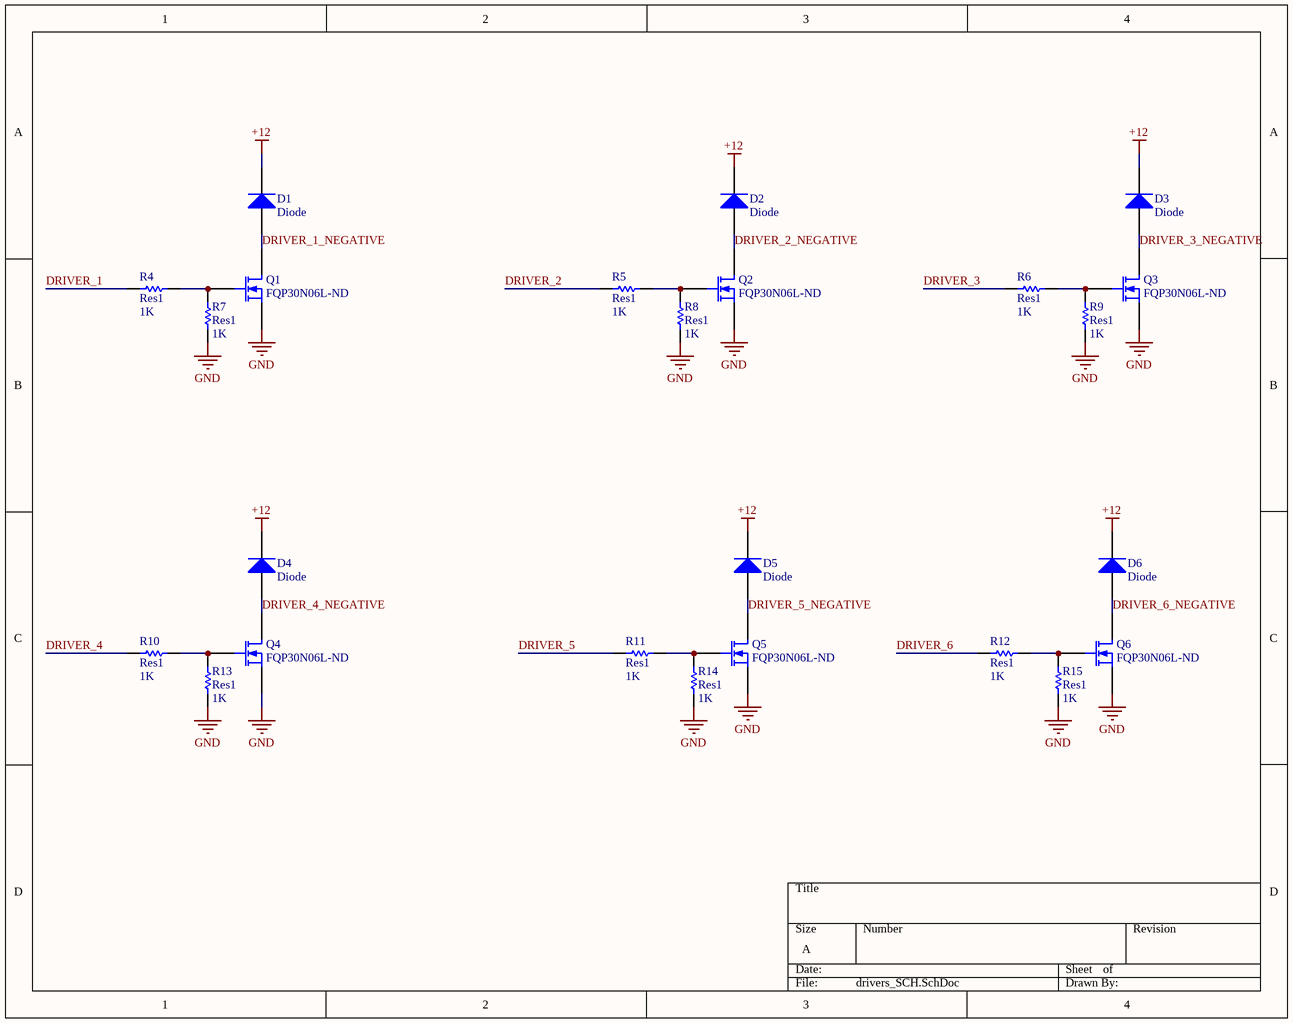
[diagram p8: drivers_SCH.SchDoc]

### Parts
D1  Diode  [DIOC2012X06N]
D2  Diode  [DIOC2012X06N]
D3  Diode  [DIOC2012X06N]
D4  Diode  [DIOC2012X06N]
D5  Diode  [DIOC2012X06N]
D6  Diode  [DIOC2012X06N]
Q1  FQP30N06L-ND  [UA78M]
Q2  FQP30N06L-ND  [UA78M]
Q3  FQP30N06L-ND  [UA78M]
Q4  FQP30N06L-ND  [UA78M]
Q5  FQP30N06L-ND  [UA78M]
Q6  FQP30N06L-ND  [UA78M]
R4  Res1  value 1K  [RESC_0805_2012]
R5  Res1  value 1K  [RESC_0805_2012]
R6  Res1  value 1K  [RESC_0805_2012]
R7  Res1  value 1K  [RESC_0805_2012]
R8  Res1  value 1K  [RESC_0805_2012]
R9  Res1  value 1K  [RESC_0805_2012]
R10  Res1  value 1K  [RESC_0805_2012]
R11  Res1  value 1K  [RESC_0805_2012]
R12  Res1  value 1K  [RESC_0805_2012]
R13  Res1  value 1K  [RESC_0805_2012]
R14  Res1  value 1K  [RESC_0805_2012]
R15  Res1  value 1K  [RESC_0805_2012]

### Nets
+12: D1.2(K) D2.2(K) D3.2(K) D4.2(K) D5.2(K) D6.2(K)
GND: Q1.3(S) Q2.3(S) Q3.3(S) Q4.3(S) Q5.3(S) Q6.3(S) R7.1 R8.1 R9.1 R13.1 R14.1 R15.1
DRIVER_1: R4.1
DRIVER_1_NEGATIVE: D1.1(A) Q1.2(G)
DRIVER_2: R5.1
DRIVER_2_NEGATIVE: D2.1(A) Q2.2(G)
DRIVER_3: R6.1
DRIVER_3_NEGATIVE: D3.1(A) Q3.2(G)
DRIVER_4: R10.1
DRIVER_4_NEGATIVE: D4.1(A) Q4.2(G)
DRIVER_5: R11.1
DRIVER_5_NEGATIVE: D5.1(A) Q5.2(G)
DRIVER_6: R12.1
DRIVER_6_NEGATIVE: D6.1(A) Q6.2(G)
NetQ1_1: Q1.1(D) R4.2 R7.2
NetQ2_1: Q2.1(D) R5.2 R8.2
NetQ3_1: Q3.1(D) R6.2 R9.2
NetQ4_1: Q4.1(D) R10.2 R13.2
NetQ5_1: Q5.1(D) R11.2 R14.2
NetQ6_1: Q6.1(D) R12.2 R15.2

### Library data of the parts
D1-D6 = Diode: Default Diode; Published: 8-Jun-2000; LatestRevisionDate: 17-Jul-2002; LatestRevisionNote: Re-released for DXP Platform.; PackageVersion: Sep-1996; PackageReference: SMC; Publisher: Altium Limited; PackageDescription: DO-214-AB/SMC; 2 C-Bend Leads; Body 7.9 x 5.9 mm, inc. leads (LxW); Code_JEDEC: DO-214-AB
Q1-Q6 = MOSFET-N: N-Channel MOSFET; Published: 8-Jun-2000; LatestRevisionDate: 17-Jul-2002; LatestRevisionNote: Re-released for DXP Platform.; PackageVersion: 1995/1996; PackageReference: E3; Publisher: Altium Limited; PackageDescription: TO, Flat Index; 3 In-Line, Axial Leads; Body Dia. 4.6mm; Lead Dia. 0.5 mm (max)
R4-R15 = Res1: Resistor; Published: 8-Jun-2000; LatestRevisionDate: 17-Jul-2002; LatestRevisionNote: Re-released for DXP Platform.; PackageReference: AXIAL-0.3; Publisher: Altium Limited; PackageDescription: Axial Device, Thru-Hole; 2 Leads; 0.3 in Pin Spacing

## Nets that join several sheets
+3V3: Power (3V3.A C41.2 VR3.2), LC_to_ADC (LCAA_EN1.1), ADC_SCH (12 pins), Load_Cells_SCH (JP2.1), Pressure_Transducers_SCH (P1.1), Connectors (Power.3 Power_H.1)
GND: PI_SCH (7 pins), Power (13 pins), PT_to_ADCs (16 pins), LC_to_ADC (20 pins), ADC_SCH (9 pins), Load_Cells_SCH (16 pins), Pressure_Transducers_SCH (16 pins), Connectors (5 pins), drivers_SCH (12 pins)
+5V: Power (6 pins), PT_to_ADCs (8 pins), Connectors (Power_H.2)
+10V: Power (5 pins), Connectors (Power_H.3 PT1.2 PT2.2)
+12V: Power (D8.1), Connectors (Power.1 Power.2 Power_H.4)
ADC1_A5: ADC_SCH (ADC1.6), Connectors (ADC_H.1)
ADC1_A6: ADC_SCH (ADC1.7), Connectors (ADC_H.2)
ADC1_A7: ADC_SCH (ADC1.8), Connectors (ADC_H.3)
ADC1_CS: PI_SCH (*.22), ADC_SCH (ADC1.10 R1.1)
ADC2_A4: ADC_SCH (ADC2.5), Connectors (ADC4.4 ADC_H.4)
ADC2_A5: ADC_SCH (ADC2.6), Connectors (ADC4.3 ADC_H.5)
ADC2_A6: ADC_SCH (ADC2.7), Connectors (ADC4.2 ADC_H.6)
ADC2_A7: ADC_SCH (ADC2.8), Connectors (ADC4.1 ADC_H.7)
ADC2_CS: PI_SCH (*.24), ADC_SCH (ADC2.10 R2.1)
ADC3_A4: ADC_SCH (ADC3.5), Connectors (ADC5.4 ADC_H.8)
ADC3_A5: ADC_SCH (ADC3.6), Connectors (ADC5.3 ADC_H.9)
ADC3_A6: ADC_SCH (ADC3.7), Connectors (ADC5.2 ADC_H.10)
ADC3_A7: ADC_SCH (ADC3.8), Connectors (ADC5.1 ADC_H.11)
ADC3_CS: PI_SCH (*.26), ADC_SCH (ADC3.10 R3.1)
DRIVER_1: PI_SCH (*.11), drivers_SCH (R4.1)
DRIVER_1_NEGATIVE: Connectors (Drivers_1.1), drivers_SCH (D1.1 Q1.2)
DRIVER_2: PI_SCH (*.13), drivers_SCH (R5.1)
DRIVER_2_NEGATIVE: Connectors (Drivers_1.2), drivers_SCH (D2.1 Q2.2)
DRIVER_3: PI_SCH (*.15), drivers_SCH (R6.1)
DRIVER_3_NEGATIVE: Connectors (Drivers_1.3), drivers_SCH (D3.1 Q3.2)
DRIVER_4: PI_SCH (*.18), drivers_SCH (R10.1)
DRIVER_5: PI_SCH (*.33), drivers_SCH (R11.1)
DRIVER_5_NEGATIVE: Connectors (Drivers_2.1), drivers_SCH (D5.1 Q5.2)
DRIVER_6: PI_SCH (*.32), drivers_SCH (R12.1)
LC1: LC_to_ADC (C16.2 IC1.4 R20.1), ADC_SCH (ADC1.1)
LC1_OUT_N: Load_Cells_SCH (IC6.2), Connectors (LC1.1)
LC1_PREC: LC_to_ADC (LCIN1.2), Load_Cells_SCH (IC6.6 RF1.1)
LC2: LC_to_ADC (C17.2 IC2.4 R23.1), ADC_SCH (ADC1.2)
LC2_OUT_N: Load_Cells_SCH (IC7.2), Connectors (LC2.3)
LC2_PREC: LC_to_ADC (LCIN2.2), Load_Cells_SCH (IC7.6 RF2.1)
LC3: LC_to_ADC (C22.2 IC3.4 R28.1), ADC_SCH (ADC1.3)
LC3_OUT_N: Load_Cells_SCH (IC8.2), Connectors (LC2.1)
LC3_OUT_P: Load_Cells_SCH (IC8.3), Connectors (LC2.2)
LC3_PREC: LC_to_ADC (LCIN3.2), Load_Cells_SCH (IC8.6 RF3.1)
LC4: LC_to_ADC (C24.2 IC4.4 R32.1), ADC_SCH (ADC1.4)
LC4_OUT_N: Load_Cells_SCH (IC9.2), Connectors (LC3.3)
LC4_PREC: LC_to_ADC (LCIN4.2), Load_Cells_SCH (IC9.6 RF4.1)
LC5: LC_to_ADC (C28.2 IC5.4 R36.1), ADC_SCH (ADC1.5)
LC5_OUT_N: Load_Cells_SCH (IC10.1 IC10.2 RF5.2 RG5.2), Connectors (LC3.1)
LC5_OUT_P: Load_Cells_SCH (IC10.3), Connectors (LC3.2)
LC5_PREC: LC_to_ADC (LCIN5.2), Load_Cells_SCH (IC10.6 RF5.1)
MISO: PI_SCH (*.21), ADC_SCH (ADC1.12 ADC2.12 ADC3.12)
MOSI: PI_SCH (*.19), ADC_SCH (ADC1.11 ADC2.11 ADC3.11)
PT1: PT_to_ADCs (IC16.3 IC16.4), ADC_SCH (ADC2.1)
PT1_OUT: Pressure_Transducers_SCH (R44.2 R45.2), Connectors (PT1.3)
PT1_PREC: PT_to_ADCs (R64.2), Pressure_Transducers_SCH (IC11.4 R50.1)
PT2: PT_to_ADCs (IC15.3 IC15.4), ADC_SCH (ADC2.2)
PT2_OUT: Pressure_Transducers_SCH (R46.2 R47.2), Connectors (PT1.1)
PT2_PREC: PT_to_ADCs (R62.2), Pressure_Transducers_SCH (IC12.4 R51.1)
PT3: PT_to_ADCs (IC18.3 IC18.4), ADC_SCH (ADC2.3)
PT3_OUT: Pressure_Transducers_SCH (R54.2 R55.2), Connectors (PT2.3)
PT3_PREC: PT_to_ADCs (R68.2), Pressure_Transducers_SCH (IC13.4 R60.1)
PT4: PT_to_ADCs (IC17.3 IC17.4), ADC_SCH (ADC2.4)
PT4_OUT: Pressure_Transducers_SCH (R56.2 R57.2), Connectors (PT2.1)
PT4_PREC: PT_to_ADCs (R66.2), Pressure_Transducers_SCH (IC14.4 R61.1)
SCK: PI_SCH (*.23), ADC_SCH (ADC1.13 ADC2.13 ADC3.13)
TC2: ADC_SCH (ADC3.2), Connectors (TC1.3)
TC3: ADC_SCH (ADC3.3), Connectors (TC1.2)
TC4: ADC_SCH (ADC3.4), Connectors (TC1.1)